# EAGLE schematic STM32F050F Base (EAGLE 6.5.0)
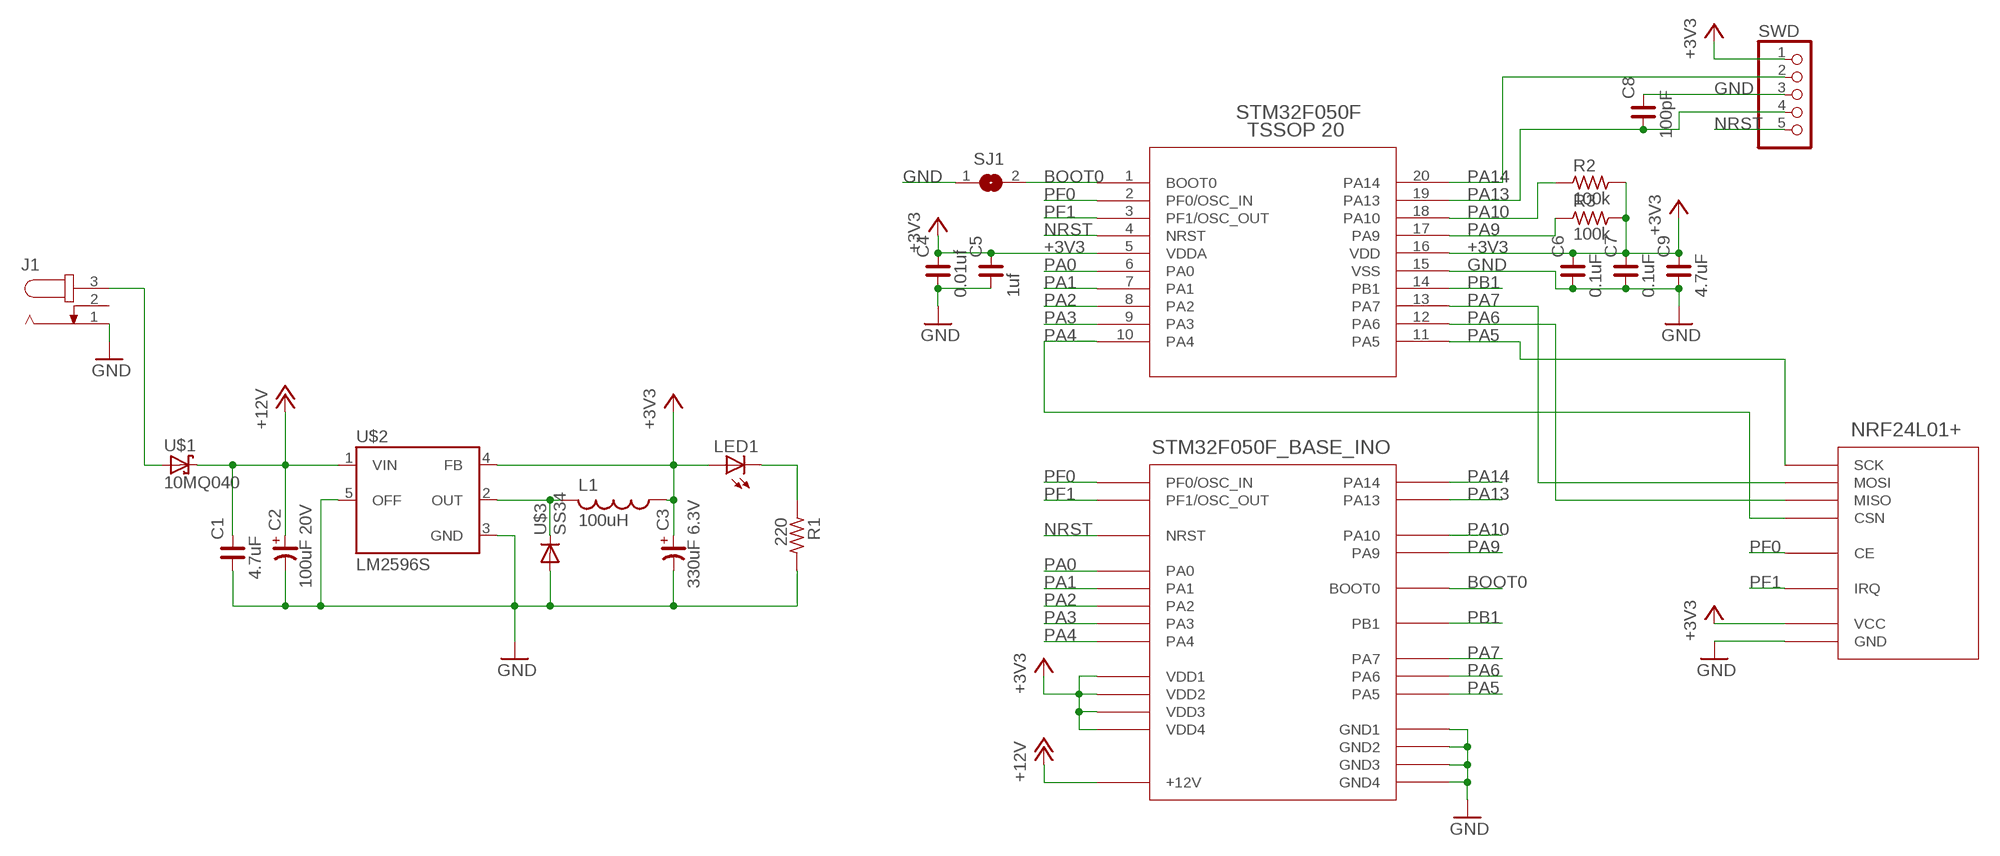
[diagram p0: schematic, sheet 1]

## Parts
C1  4.7uF  C_1206  [C1206]
C2  100uF 20V  CP_7343  [C7343/T]
C3  330uF 6.3V  CP_7343  [C7343/T]
C4  0.01uf  C_1206  [C1206]
C5  1uf  C_1206  [C1206]
C6  0.1uF  C_1206  [C1206]
C7  0.1uF  C_1206  [C1206]
C8  100pF  C_1206  [C1206]
C9  4.7uF  C_1206  [C1206]
J1  JACK-PLUG0  [SPC4077]
L1  100uH  L-USWE-TPC  [POWER-CHOKE_WE-TPC]
LED1  LEDCHIPLED_1206  [CHIPLED_1206]
R1  220  R_1206  [R1206]
R2  100k  R_1206  [R1206]
R3  100k  R_1206  [R1206]
SJ1  SJ  [SJ]
SWD  PINHD-1X05_2.54-90°-S  [1X05/90-S]
U$1  10MQ040  [SMA]
U$2  LM2596S  [TO263-5]
U$3  SS34  DIODE-SMC  [SMC]
U$4  STM32F050F4P6  [TSSOP20]
U$5  STM32F050F_BASE_INO  [STM32_BASE_INO]
U$6  NRF24L01+  [NRF24L01+]

## Nets
+3V3: C3.+ C4.2 C5.2 C6.2 C7.2 C9.2 L1.1 LED1.A R2.2 R3.2 SWD.1 U$2.4(FB) U$4.5(VDDA) U$4.16(VDD) U$5.VDD1 U$5.VDD2 U$5.VDD3 U$5.VDD4 U$6.VCC
+12V: C1.2 C2.+ U$1.C U$2.1(VIN) U$5.+12V
BOOT0: SJ1.2 U$4.1(BOOT0) U$5.BOOT0
GND: C1.1 C2.- C3.- C4.1 C5.1 C6.1 C7.1 C8.2 C9.1 J1.1 R1.2 SJ1.1 SWD.3 U$2.3(GND) U$2.5(OFF) U$3.A U$4.15(VSS) U$5.GND1 U$5.GND2 U$5.GND3 U$5.GND4 U$6.GND
N$1: LED1.C R1.1
N$23: J1.3 U$1.A
N$34: L1.2 U$2.2(OUT) U$3.C
NRST: SWD.5 U$4.4(NRST) U$5.NRST
PA0: U$4.6(PA0) U$5.PA0
PA1: U$4.7(PA1) U$5.PA1
PA2: U$4.8(PA2) U$5.PA2
PA3: U$4.9(PA3) U$5.PA3
PA4: U$4.10(PA4) U$5.PA4 U$6.CSN
PA5: U$4.11(PA5) U$5.PA5 U$6.SCK
PA6: U$4.12(PA6) U$5.PA6 U$6.MISO
PA7: U$4.13(PA7) U$5.PA7 U$6.MOSI
PA9: R3.1 U$4.17(PA9) U$5.PA9
PA10: R2.1 U$4.18(PA10) U$5.PA10
PA13: C8.1 SWD.4 U$4.19(PA13) U$5.PA13
PA14: SWD.2 U$4.20(PA14) U$5.PA14
PB1: U$4.14(PB1) U$5.PB1
PF0: U$4.2(PF0/OSC_IN) U$5.PF0(PF0/OSC_IN) U$6.CE
PF1: U$4.3(PF1/OSC_OUT) U$5.PF1(PF1/OSC_OUT) U$6.IRQ
Unconnected: J1.2

## Library data of the parts
C1 C4-C9 = rc-master-smd:C_: NON-POLARIZED CAP
C2 C3 = rc-master-smd:CP_: POLARIZED CAP
J1 = con-jack:JACK-PLUG: DC POWER JACK Power Jack, DC, Right Angle, Through Hole, Rated 5A at 16VDC, PC Terminals Distributor: Farnell (www.Farnell.de) Drawing: 84N1161.pdf / 84N1162.pdf Manufacturer: SPC Technology (www.spctechnology.com) Type: SPC4077 / SPC 4078; OC_FARNELL: unknown; OC_NEWARK: unknown
L1 = rcl:L-US: INDUCTOR, American symbol; SDR0604-470KL: 47uH
LED1 = led:LED: LED OSRAM: - CHIPLED LG R971, LG N971, LY N971, LG Q971, LY Q971, LO R971, LY R971 LH N974, LH R974 LS Q976, LO Q976, LY Q976 LO Q996 - Hyper CHIPLED LW Q18S LB Q993, LB Q99A, LB R99A - SideLED LS A670, LO A670, LY A670, LG A670, LP A670 LB A673, LV A673, LT A673, LW A673 LH A674 LY A675 LS A676, LA A676, LO A676, LY A676, LW A676 LS A679, LY A679, LG A679 - Hyper Micro SIDELED® LS Y876, LA Y876, LO Y876, LY Y876 LT Y87S - SmartLED LW L88C, LW L88S LB L89C, LB L89S, LG L890 LS L89K, LO L89K, LY L89K LS L896, LA L896, LO L896, LY L896 - TOPLED LS T670, LO T670, LY T670, LG T670, LP T670 LSG T670, LSP T670, LSY T670, LOP T670, LYG T670 LG T671, LOG T671, LSG T671 LB T673, LV T673, LT T673, LW T673 LH T674 LS T676, LA T676, LO T676, LY T676, LB T676, LH T676, LSB T676, LW T676 LB T67C, LV T67C, LT T67C, LS T67K, LO T67K, LY T67K, LW E67C LS E67B, LA E67B, LO E67B, LY E67B, LB E67C, LV E67C, LT E67C LW T67C LS T679, LY T679, LG T679 LS T770, LO T770, LY T770, LG T770, LP T770 LB T773, LV T773, LT T773, LW T773 LH T774 LS E675, LA E675, LY E675, LS T675 LS T776, LA T776, LO T776, LY T776, LB T776 LHGB T686 LT T68C, LB T68C - Hyper Mini TOPLED® LB M676 - Mini TOPLED Santana® LG M470 LS M47K, LO M47K, LY M47K Source: http://www.osram.convergy.de LUXEON: - LUMILED® LXK2-PW12-R00, LXK2-PW12-S00, LXK2-PW14-U00, LXK2-PW14-V00 LXK2-PM12-R00, LXK2-PM12-S00, LXK2-PM14-U00 LXK2-PE12-Q00, LXK2-PE12-R00, LXK2-PE12-S00, LXK2-PE14-T00, LXK2-PE14-U00 LXK2-PB12-K00, LXK2-PB12-L00, LXK2-PB12-M00, LXK2-PB14-N00, LXK2-PB14-P00, LXK2-PB14-Q00 LXK2-PR12-L00, LXK2-PR12-M00, LXK2-PR14-Q00, LXK2-PR14-R00 LXK2-PD12-Q00, LXK2-PD12-R00, LXK2-PD12-S00 LXK2-PH12-R00, LXK2-PH12-S00 LXK2-PL12-P00, LXK2-PL12-Q00, LXK2-PL12-R00 Source: www.luxeon.com KINGBRIGHT: KA-3528ASYC Source: www.kingbright.com
R1-R3 = rc-master-smd:R_: RESISTOR
SJ1 = jumper:SJ: SMD solder JUMPER
SWD = pinhead-2:PINHD-1X05: PIN HEADER
U$1 = my-library:10MQ040: SCHOTTKY
U$2 = my-library:LM2596: LM2596
U$3 = diode:DIODE-: DIODE
U$4 = STM32F0:STM32F050F4P6: STM32F050F4P6
U$5 = my-library:STM32F050F_BASE_INO
U$6 = my-library:NRF24L01+: NRF24L01+ wireless data transmission module 2.4G